# Altium schematic sheet main.SchDoc
size A4
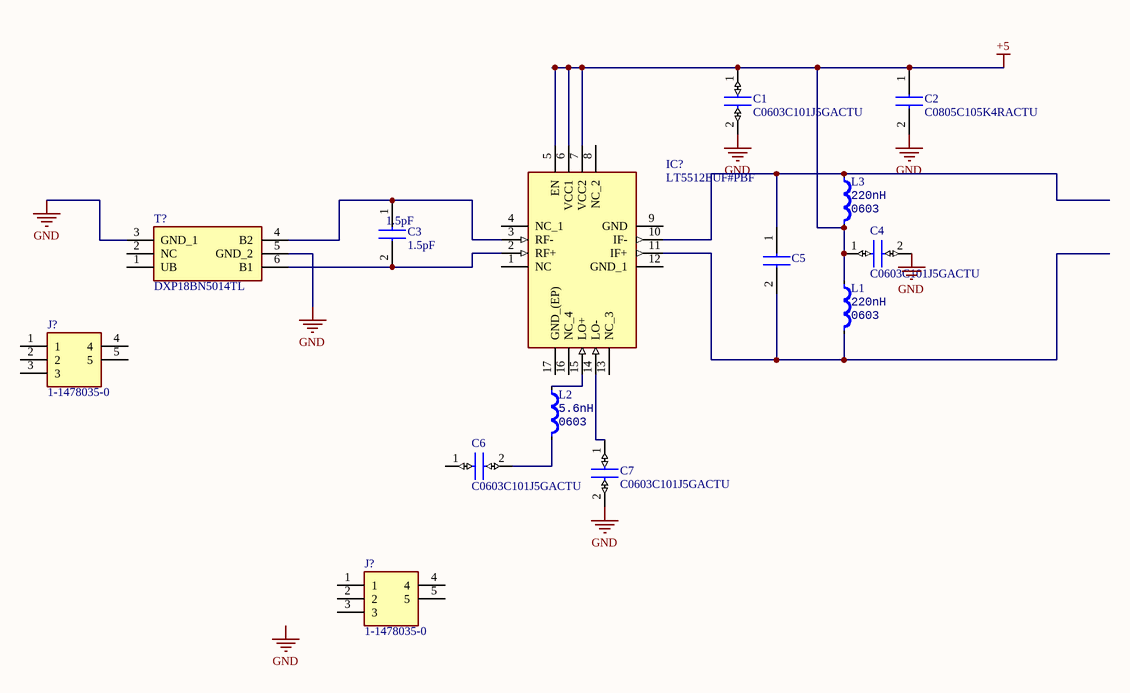
[diagram p0: main.SchDoc]

## Parts
(Parts that share a designator on the sheet are numbered #1, #2 ... from top to bottom, then left to right.)
C1  C0603C101J5GACTU  [CAPC1608X87N]
C2  C0805C105K4RACTU  [CAPC2012X100N]
C3  1.5pF  [CAPC1608X90N]
C4  C0603C101J5GACTU  [CAPC1608X87N]
C5  VJ0402D8R2CXCAJ  (value not drawn)
C6  C0603C101J5GACTU  [CAPC1608X87N]
C7  C0603C101J5GACTU  [CAPC1608X87N]
IC?  LT5512EUF#PBF  [QFN65P400X400X80-17N-D]
J?#1  1-1478035-0  [114780350]
J?#2  1-1478035-0  [114780350]
L1  Type: 0603  (hidden comment: 220nH)
L2  Type: 0603  (hidden comment: 5.6nH)
L3  Type: 0603  (hidden comment: 220nH)
T?  DXP18BN5014TL  [DXP18BN5014TL]

## Nets
+5: C1.1 C2.1 C4.1 IC?.5(EN) IC?.6(VCC1) IC?.7(VCC2) L1.1 L3.2
GND: C1.2 C2.2 C4.2 C7.2 T?.3(GND_1) T?.5(GND_2)
NetC3_1: C3.1 IC?.3(RF-) T?.4(B2)
NetC3_2: C3.2 IC?.2(RF+) T?.6(B1)
NetC5_1: C5.1 IC?.10(IF-) L3.1
NetC5_2: C5.2 IC?.11(IF+) L1.2
NetC6_2: C6.2 L2.2
NetC7_1: C7.1 IC?.14(LO-)
NetIC?_15: IC?.15(LO+) L2.1

Not connected (* = marked no-connect by the designer): C6 1; IC? 1(NC) 4(NC_1) 8(NC_2) 9(GND) 12(GND_1) 13(NC_3) 16(NC_4) 17(GND_(EP)); J?#1 1 2 3 4 5; J?#2 1 2 3 4 5; T? 1(UB) 2(NC)

## Notes on the sheet
- Labels drawn without touching a wire or pin: GND

## Library data of the parts
C1 C4 C6 C7 = C0603C101J5GACTU: Capacitor; Manufacturer_Name: Kemet; Allied_Number: 70096904; Datasheet Link: http://docs-emea.rs-online.com/webdocs/116e/0900766b8116eaf8.pdf; Height: 0.87mm; Manufacturer_Part_Number: C0603C101J5GACTU; Mouser Part Number: 80-C0603C101J5G; Mouser Price/Stock: https://www.mouser.com/Search/Refine.aspx?Keyword=80-C0603C101J5G; RS Part Number: 2644523P; RS Price/Stock: http://uk.rs-online.com/web/p/products/2644523P; Allied Price/Stock: https://www.alliedelec.com/kemet-c0603c101j5gactu/70096904/
C2 = C0805C105K4RACTU: Capacitor; Manufacturer_Name: Kemet; Datasheet Link: http://www.kemet.com/Lists/ProductCatalog/Attachments/53/KEM_C1002_X7R_SMD.pdf; Height: 1mm; Manufacturer_Part_Number: C0805C105K4RACTU; Mouser Part Number: 80-C0805C105K4R; Mouser Price/Stock: https://www.mouser.com/Search/Refine.aspx?Keyword=80-C0805C105K4R; RS Part Number: 4515770P; RS Price/Stock: http://uk.rs-online.com/web/p/products/4515770P
C3 = 06032U1R5BAT2A: Capacitor; Manufacturer_Name: AVX; Allied_Number: 70473499; Datasheet Link: http://www.mouser.com/catalog/supplier/library/pdf/AVXSurfaceMountCeramic.pdf; Height: 0.9mm; Manufacturer_Part_Number: 06032U1R5BAT2A; Mouser Part Number: 581-06032U1R5BAT2A; Mouser Price/Stock: http://www.mouser.com/Search/ProductDetail.aspx?qs=HHtk9%2fstK94%2fdhQq%2fiZoHQ%3d%3d; RS Part Number: 6983986; RS Price/Stock: https://uk.rs-online.com/web/p/products/6983986; Allied Price/Stock: https://www.alliedelec.com/avx-06032u1r5bat2a/70473499/; value: 1.5pF
C5 = VJ0402D8R2CXCAJ: 8.2pF Capacitor; Manufacturer_Name: AVX; Manufacturer_Part_Number: 06032U1R5BAT2A; Allied_Number: 70473499; Datasheet Link: http://www.mouser.com/catalog/supplier/library/pdf/AVXSurfaceMountCeramic.pdf; Height: 0.9mm; Mouser Part Number: 581-06032U1R5BAT2A; Mouser Price/Stock: http://www.mouser.com/Search/ProductDetail.aspx?qs=HHtk9%2fstK94%2fdhQq%2fiZoHQ%3d%3d; RS Part Number: 6983986; RS Price/Stock: https://uk.rs-online.com/web/p/products/6983986; Allied Price/Stock: https://www.alliedelec.com/avx-06032u1r5bat2a/70473499/
IC? = LT5512EUF#PBF: Integrated Circuit; Manufacturer_Name: Linear Technology; Datasheet Link: http://cds.linear.com/docs/en/datasheet/5512fa.pdf; Height: 0.8mm; Manufacturer_Part_Number: LT5512EUF#PBF; RS Part Number: 5060861P; RS Price/Stock: http://uk.rs-online.com/web/p/products/5060861P
J?#1 J?#2 = 1-1478035-0: Connector; Manufacturer_Name: TE Connectivity; Allied_Number: 70283401; Datasheet Link: https://www.te.com/commerce/DocumentDelivery/DDEController?Action=showdoc&DocId=Customer+Drawing%7F1478035%7FB1%7Fpdf%7FEnglish%7FENG_CD_1478035_B1.pdf%7F1-1478035-0; Height: 18.6mm; Manufacturer_Part_Number: 1-1478035-0; Mouser Part Number: 571-1-1478035-0; Mouser Price/Stock: https://www.mouser.com/Search/Refine.aspx?Keyword=571-1-1478035-0; RS Part Number: 1641425; RS Price/Stock: http://uk.rs-online.com/web/p/products/1641425; Allied Price/Stock: https://www.alliedelec.com/teconnectivity-1-1478035-0/70283401/
L1 L3 = B82496C3829J000: Inductor; Specification: ±5% 100mA; Manufacturer: *; Value: 220nH
L2 = B82496C3569J000: Inductor; Specification: ±5% 100mA; Manufacturer: *; Value: 5.6nH
T? = DXP18BN5014TL: Transformer; Manufacturer_Name: Murata Electronics; Datasheet Link: https://www.murata.com/en-us/products/productdata/8796776071198/EFKA0002.pdf; Height: 0.55mm; Manufacturer_Part_Number: DXP18BN5014TL; Mouser Part Number: 81-DXP18BN5014TL; Mouser Price/Stock: https://www.mouser.com/Search/Refine.aspx?Keyword=81-DXP18BN5014TL; RS Part Number: 8390904P; RS Price/Stock: http://uk.rs-online.com/web/p/products/8390904P